# EAGLE design b_SI_Boost (EAGLE 9.2.2)
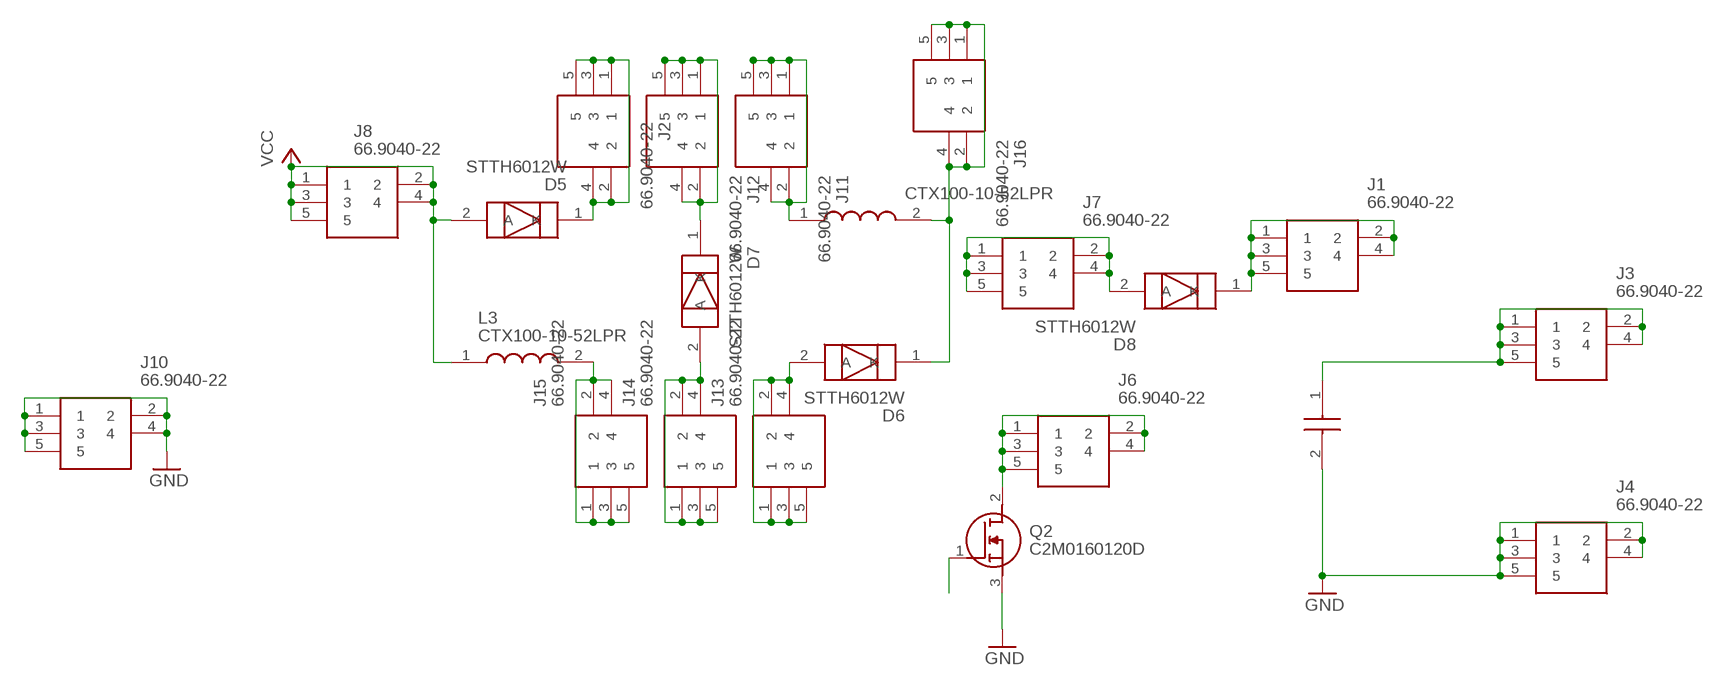
[diagram p0: schematic, sheet 1]

## Parts
D5  STTH6012W  [TO1090P515X1560X2445-2P]
D6  STTH6012W  [TO1090P515X1560X2445-2P]
D7  STTH6012W  [TO1090P515X1560X2445-2P]
D8  STTH6012W  [TO1090P515X1560X2445-2P]
J1  66.9040-22  [66904022]
J2  66.9040-22  [66904022]
J3  66.9040-22  [66904022]
J4  66.9040-22  [66904022]
J6  66.9040-22  [66904022]
J7  66.9040-22  [66904022]
J8  66.9040-22  [66904022]
J10  66.9040-22  [66904022]
J11  66.9040-22  [66904022]
J12  66.9040-22  [66904022]
J13  66.9040-22  [66904022]
J14  66.9040-22  [66904022]
J15  66.9040-22  [66904022]
J16  66.9040-22  [66904022]
L3  CTX100-10-52LPR  [CTX1001052LPR]
L4  CTX100-10-52LPR  [CTX1001052LPR]
Q2  C2M0160120D  [TO544P521X1594X2550-3P]
U$1  B32774D4505K000  [B32774D4505K000]

## Nets
GND: J4.1 J4.2 J4.3 J4.4 J4.5 J10.1 J10.2 J10.3 J10.4 J10.5 Q2.3(S) U$1.2
N$1: J15.1 J15.2 J15.3 J15.4 J15.5 L3.2
N$2: D7.2(A) J14.1 J14.2 J14.3 J14.4 J14.5
N$3: D6.1(K) J16.1 J16.2 J16.3 J16.4 J16.5 L4.2
N$4: D8.1(K) J1.1 J1.2 J1.3 J1.4 J1.5
N$5: J3.1 J3.2 J3.3 J3.4 J3.5 U$1.1
N$6: J6.1 J6.2 J6.3 J6.4 J6.5 Q2.2(D)
N$8: D8.2(A) J7.1 J7.2 J7.3 J7.4 J7.5
N$9: Q2.1(G)
N$10: D6.2(A) J13.1 J13.2 J13.3 J13.4 J13.5
N$11: D7.1(K) J12.1 J12.2 J12.3 J12.4 J12.5
N$13: D5.1(K) J2.1 J2.2 J2.3 J2.4 J2.5
N$14: J11.1 J11.2 J11.3 J11.4 J11.5 L4.1
VCC: D5.2(A) J8.1 J8.2 J8.3 J8.4 J8.5 L3.1

## Library data of the parts
D5-D8 = SamacSys_Parts:STTH6012W: STTH6012W, Fast Recovery Rectifier Diode, Switching 60A max, 1200V 125ns, 2-Pin, DO-247 Source: Datasheet <http://www.st.com/web/en/resource/technical/document/datasheet/CD00096472.pdf>; ALLIED_NUMBER: 70014108; ALLIED_PRICE-STOCK: http://www.alliedelec.com/stmicroelectronics-stth6012w/70014108/; ARROW_PART_NUMBER: STTH6012W; ARROW_PRICE-STOCK: https://www.arrow.com/en/products/stth6012w/stmicroelectronics; DESCRIPTION: STTH6012W, Fast Recovery Rectifier Diode, Switching 60A max, 1200V 125ns, 2-Pin, DO-247; HEIGHT: 5.15mm; MANUFACTURER_NAME: STMicroelectronics; MANUFACTURER_PART_NUMBER: STTH6012W; RS_PART_NUMBER: 6870818; RS_PRICE-STOCK: http://uk.rs-online.com/web/p/rectifier-schottky-diodes/6870818/?source=DS
J1-J4 J6-J8 J10-J16 = SamacSys_Parts:66.9040-22: STAUBLI - 66.9040-22 - SOCKET, PCB, 4MM, R/A, RED Source: Datasheet <http://www.farnell.com/datasheets/1479998.pdf>; ALLIED_NUMBER: 70749834; ALLIED_PRICE-STOCK: https://www.alliedelec.com/staubli-66-9040-22/70749834/; ARROW_PART_NUMBER: 66.9040-22; DESCRIPTION: STAUBLI - 66.9040-22 - SOCKET, PCB, 4MM, R/A, RED; HEIGHT: 11mm; MANUFACTURER_NAME: STAUBLI; MANUFACTURER_PART_NUMBER: 66.9040-22
L3 L4 = SamacSys_Parts:CTX100-10-52LPR: Fixed Inductors 100uH 13A Source: Datasheet <http://www.cooperindustries.com/content/dam/public/bussmann/Electronics/Resources/product-datasheets/Bus_Elx_DS_PM 4304_LPCI_Series.pdf>; ARROW_PART_NUMBER: CTX100-10-52LPR; DESCRIPTION: Fixed Inductors 100uH 13A; HEIGHT: 27.5mm; MANUFACTURER_NAME: Eaton; MANUFACTURER_PART_NUMBER: CTX100-10-52LPR
Q2 = SamacSys_Parts:C2M0160120D: Wolfspeed C2M0160120D N-channel SiC MOSFET Transistor, 19 A, 1200 V, 3-Pin TO-247 Source: Datasheet <http://www.wolfspeed.com/media/downloads/169/C2M0160120D.pdf>; ARROW_PART_NUMBER: C2M0160120D; ARROW_PRICE-STOCK: http://uk.rs-online.com/web/p/products/1629709; DESCRIPTION: Wolfspeed C2M0160120D N-channel SiC MOSFET Transistor, 19 A, 1200 V, 3-Pin TO-247; HEIGHT: 5.21mm; MANUFACTURER_NAME: Wolfspeed; MANUFACTURER_PART_NUMBER: C2M0160120D; RS_PART_NUMBER: 1629709; RS_PRICE-STOCK: http://uk.rs-online.com/web/p/products/1629709
U$1 = SamacSys_Parts:B32774D4505K000: Epcos B32774D 5F Polypropylene Film Capacitor 450 V dc 10% Source: Datasheet <https://en.tdk-electronics.tdk.com/inf/20/20/db/fc_2009/MKP_B32774_778.pdf>; ARROW_PART_NUMBER: B32774D4505K000; ARROW_PRICE-STOCK: https://www.arrow.com/en/products/b32774d4505k000/epcos-tdk; DESCRIPTION: Epcos B32774D 5F Polypropylene Film Capacitor 450 V dc 10%; HEIGHT: 21mm; MANUFACTURER_NAME: EPCOS; MANUFACTURER_PART_NUMBER: B32774D4505K000; RS_PART_NUMBER: 1726009; RS_PRICE-STOCK: http://uk.rs-online.com/web/p/products/1726009

## Board
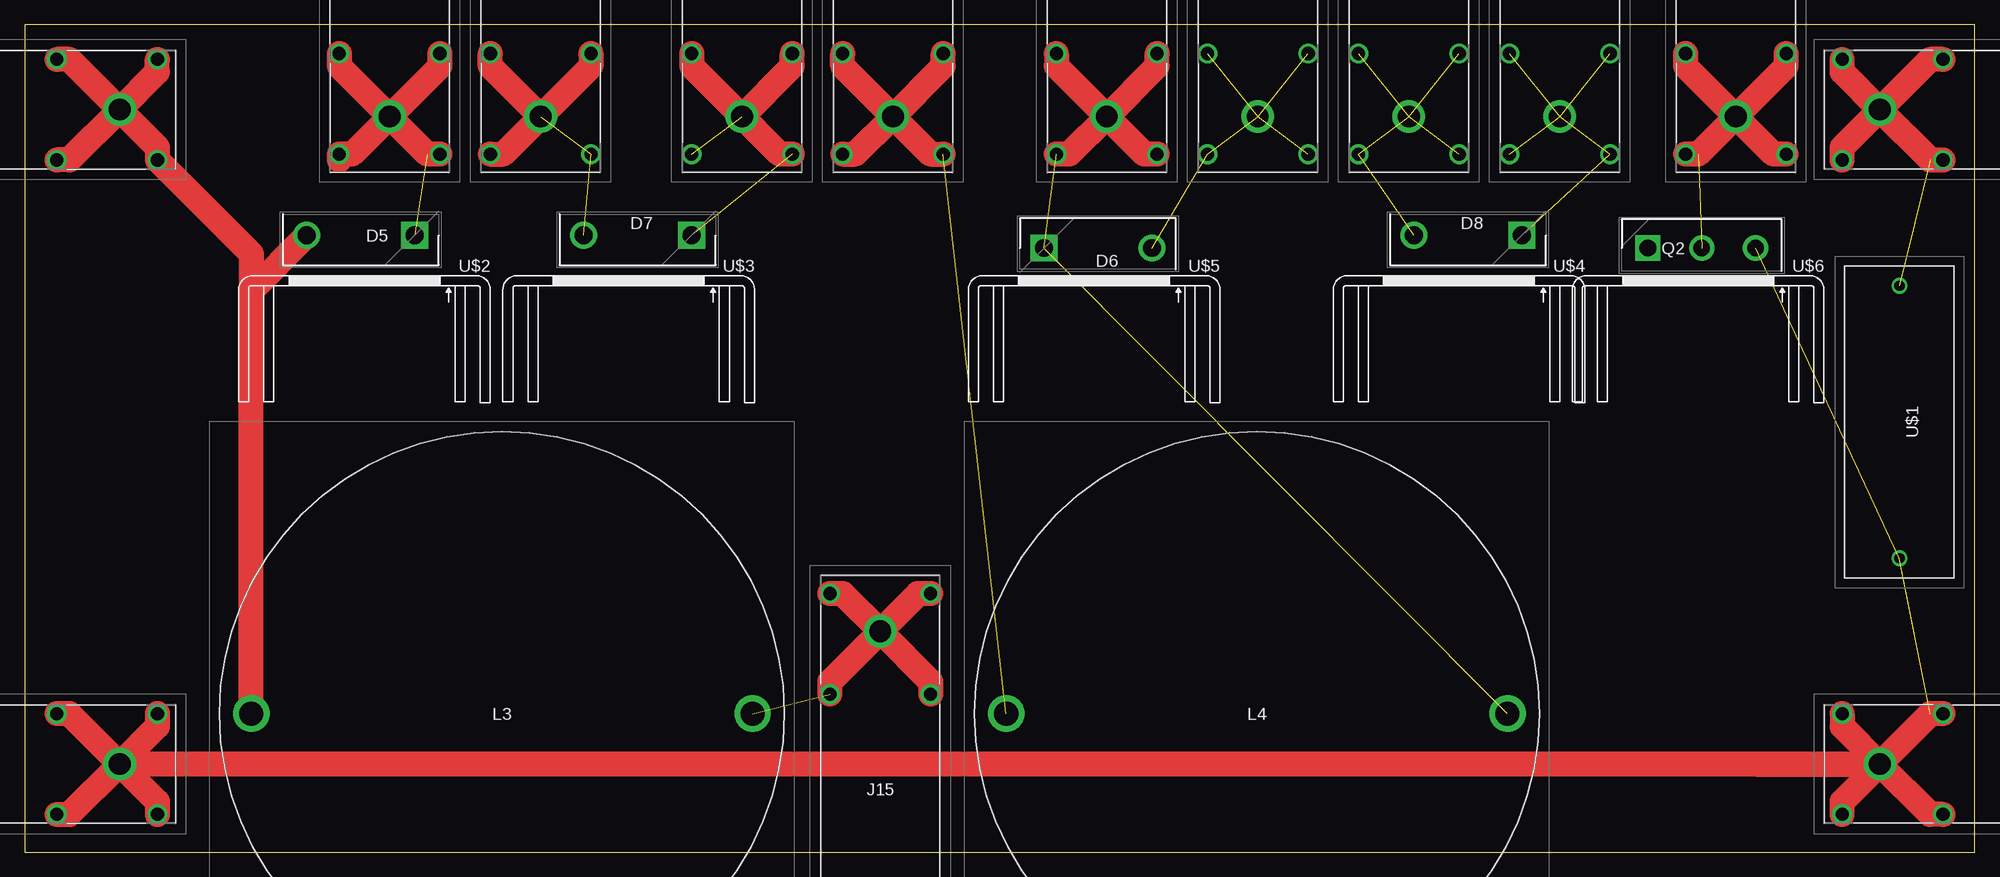
[diagram p1: board, top side]

Size 196.83 x 83.49 mm. Coordinates in mm from the lower left corner, seen from the top.
Outline: 0,0 196.83,0 196.83,83.49 0,83.49 0,0
Copper layers (1*16): Top 0.035mm / dielectric 1.5mm / Bottom 0.035mm
Design rules "default": minimum track width 6mil, minimum drill 0.35mm, track to track 6mil, track to pad 6mil, pad to pad 6mil, via to via 6mil, smd to smd 6mil, copper to edge 40mil, drill to drill 6mil, minimum pad ring 10mil, minimum via ring 8mil, stop-mask expansion 4mil, vias tented up to drill 0mil, thermal gap 10mil

### Footprints (pad centres in the part's own frame; a part is rotated, then mirrored left to right if it is on the bottom)
TO1090P515X1560X2445-2P = drill 1.81 pad 2.715 square: 1 0,0 | drill 1.81 pad 2.715: 2 10.9,0
66904022 = drill 1.33 pad 1.995: 1 -5.08,-14.66; 2 5.08,-14.66; 3 5.08,-4.5; 4 -5.08,-4.5 | drill 2.2 pad 3.3: 5 0,-10.86
CTX1001052LPR = drill 2.45 pad 3.675: 1 0,0; 2 50.6,0
TO544P521X1594X2550-3P = drill 1.69 pad 2.535 square: 1 0,0 | drill 1.69 pad 2.535: 2 5.44,0; 3 10.88,0
B32774D4505K000 = drill 1.05 pad 1.575: 1 0,0; 2 27.5,0

### Placement (x,y rotation side)
D5  39.37,62.23 180 top
D6  102.87,60.96 0 top
D7  67.31,62.23 180 top
D8  151.13,62.23 180 top
J1  154.94,85.09 0 top
J2  36.83,85.09 0 top
J3  198.12,74.93 270 top
J4  198.12,8.89 270 top
J6  172.72,85.09 0 top
J7  139.7,85.09 0 top
J8  -1.27,74.93 90 top
J10  -1.27,8.89 90 top
J11  87.63,85.09 0 top
J12  72.39,85.09 0 top
J13  124.46,85.09 0 top
J14  52.07,85.09 0 top
J15  86.36,11.43 180 top
J16  109.22,85.09 0 top
L3  22.86,13.97 0 top
L4  99.06,13.97 0 top
Q2  163.83,60.96 0 top
U$1  189.23,57.15 270 top
U$2  [FK213]  34.29,57.15 180 top
U$3  [FK213]  60.96,57.15 180 top
U$4  [FK213]  144.78,57.15 180 top
U$5  [FK213]  107.95,57.15 180 top
U$6  [FK213]  168.91,57.15 180 top

### Tracks (layer width: path | path; a pad name or v marks a point on that pad's centre or on a via)
GND  (2 unrouted)
  Top 2.54: J4.5 J10.5 | J4.4 192.34,13.97 J4.5 | J4.1 183.46,12.69 J4.5 | J4.2 183.46,5.09 J4.5 | J4.3 192.34,3.81 J4.5 | J10.2 13.39,12.69 J10.5 | J10.5 13.39,5.09 J10.1 | J10.4 4.51,3.81 J10.5 | J10.5 4.51,13.97 J10.3 | 174.71,8.89 J4.5 | 189.23,10.86 J4.5
N$1  (1 unrouted)
  Top 2.54: J15.1 90.16,26.09 J15.5 | J15.5 82.56,26.09 J15.2 | J15.3 81.28,17.21 J15.5 | J15.5 91.44,17.21 J15.4
N$2  (2 unrouted)
  Top 2.54: J14.1 48.27,70.43 J14.5 | J14.3 57.15,79.31 J14.5 | J14.5 46.99,79.31 J14.4
N$3  (2 unrouted)
  Top 2.54: J16.4 104.14,79.31 J16.5 | J16.5 114.3,79.31 J16.3 | J16.2 113.02,70.43 J16.5 | J16.5 105.42,70.43 J16.1
N$4  (5 unrouted)
N$5  (1 unrouted)
  Top 2.54: J3.2 183.46,71.13 J3.5 | J3.5 183.46,78.73 J3.1 | J3.4 192.34,80.01 J3.5 | J3.5 192.34,69.85 J3.3 | 189.23,72.96 J3.5
N$6  (1 unrouted)
  Top 2.54: J6.4 167.64,79.31 J6.5 | J6.5 177.8,79.31 J6.3 | J6.2 176.52,70.43 J6.5 | J6.5 168.92,70.43 J6.1 | 169.27,70.78 J6.5
N$8  (5 unrouted)
N$10  (5 unrouted)
N$11  (2 unrouted)
  Top 2.54: J12.4 67.31,79.31 J12.5 | J12.5 77.47,79.31 J12.3 | J12.2 76.19,70.43 J12.5 | 73.94,72.67 J12.5
N$13  (1 unrouted)
  Top 2.54: J2.4 31.75,79.31 J2.5 | J2.5 41.91,79.31 J2.3 | J2.2 40.63,70.43 J2.5 | J2.5 33.03,70.43 J2.1 31.75,69.85
N$14  (1 unrouted)
  Top 2.54: J11.1 83.83,70.43 J11.5 | J11.5 91.43,70.43 J11.2 | J11.5 92.71,79.31 J11.3 | J11.5 82.55,79.31 J11.4
VCC
  Top 2.54: L3.1 22.86,54.61 22.86,56.62 | 22.86,56.62 D5.2 | J8.5 13.39,78.73 J8.2 | J8.5 4.51,80.01 J8.3 | J8.5 4.51,69.85 J8.4 | J8.5 13.39,71.13 J8.1 22.86,60.38 22.86,56.62